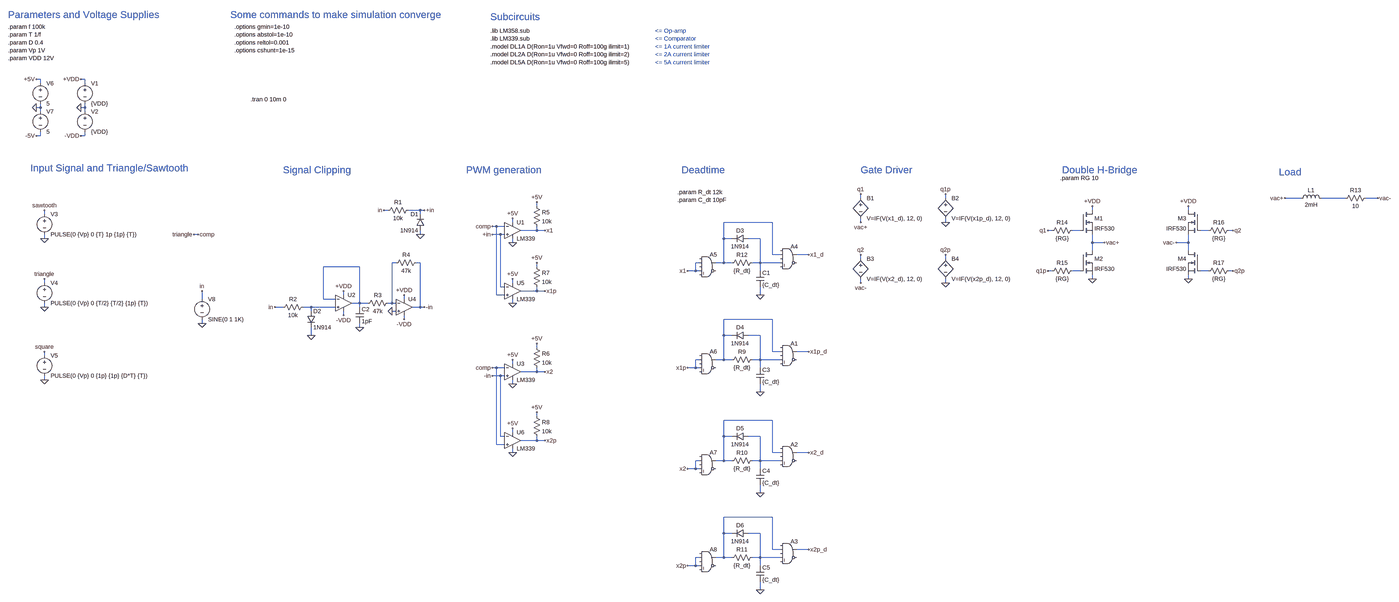
[diagram p0: schematic amp.asc, whole sheet]
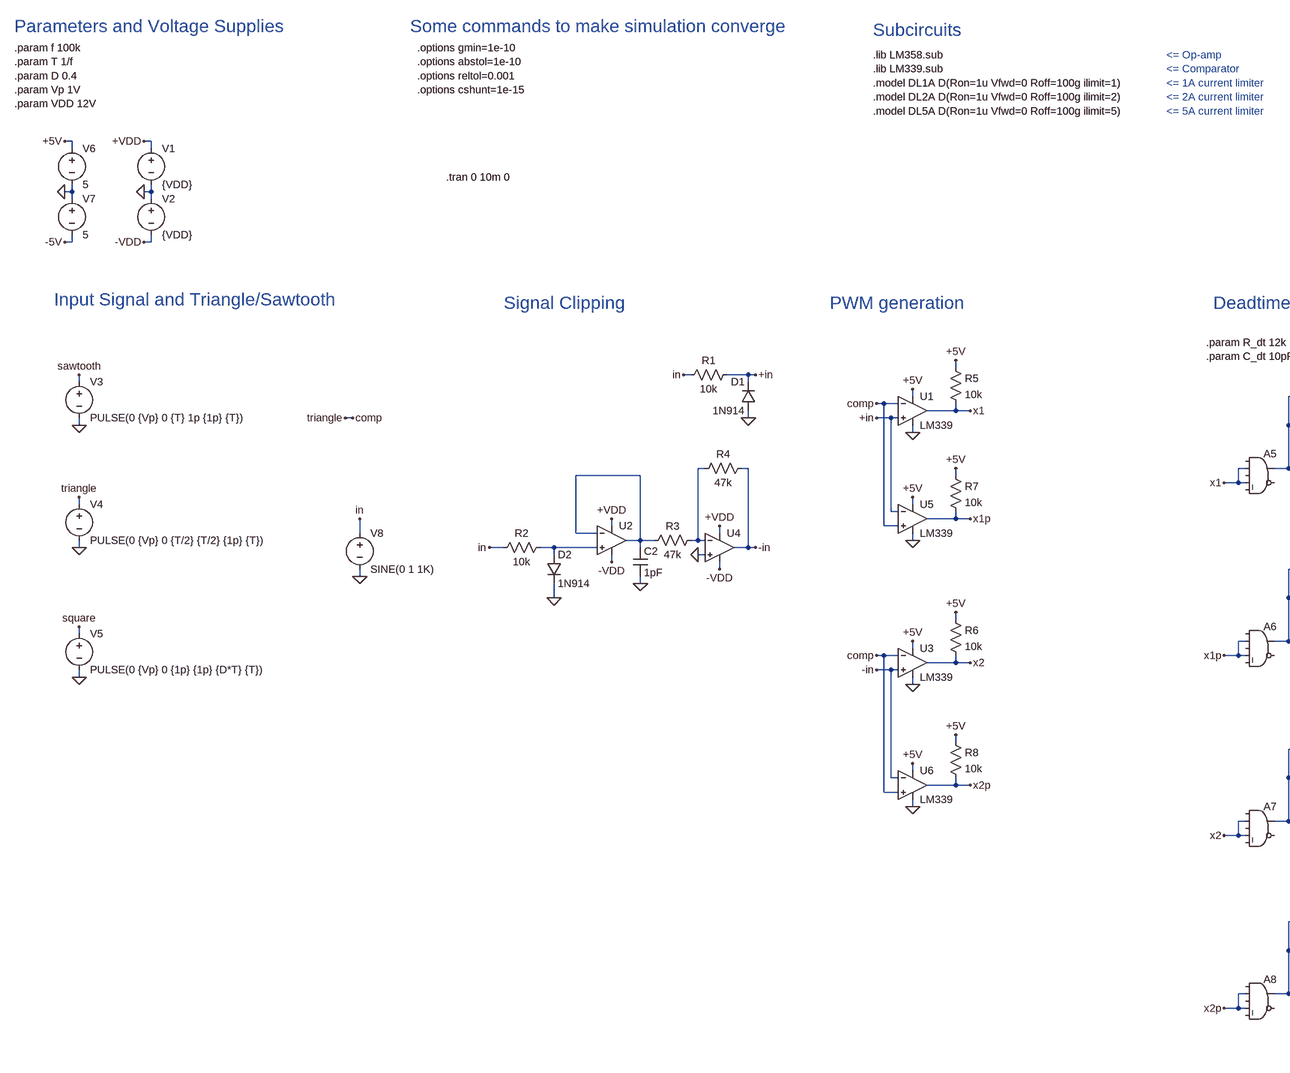
[diagram p1: schematic amp.asc, part, row 1 of 1, column 1 of 2]
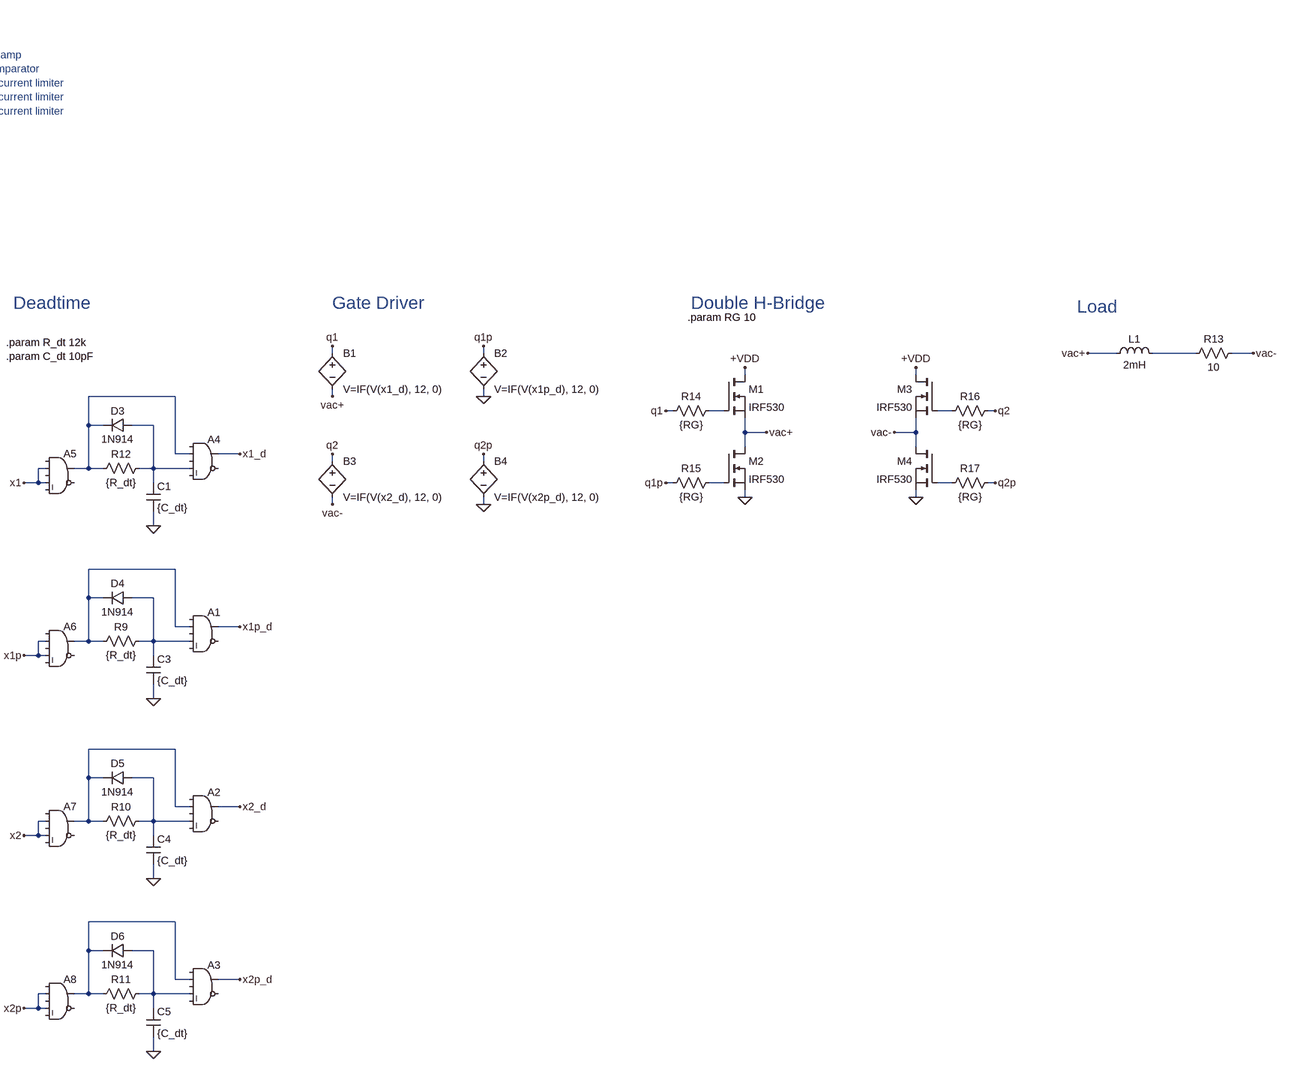
[diagram p2: schematic amp.asc, part, row 1 of 1, column 2 of 2]
amp.asc, the LTspice schematic file:
Version 4
SHEET 1 5540 1748
WIRE -336 -368 -352 -368
WIRE -160 -368 -176 -368
WIRE -336 -352 -336 -368
WIRE -160 -352 -160 -368
WIRE -336 -256 -336 -272
WIRE -336 -256 -352 -256
WIRE -160 -256 -160 -272
WIRE -160 -256 -176 -256
WIRE -336 -240 -336 -256
WIRE -160 -240 -160 -256
WIRE -336 -144 -336 -160
WIRE -336 -144 -352 -144
WIRE -160 -144 -160 -160
WIRE -160 -144 -176 -144
WIRE 3088 128 3088 112
WIRE 3424 128 3424 112
WIRE 5168 128 5104 128
WIRE 5344 128 5248 128
WIRE 5472 128 5424 128
WIRE 1696 160 1696 144
WIRE 1040 176 1024 176
WIRE 1168 176 1120 176
WIRE 1184 176 1168 176
WIRE 4192 176 4192 160
WIRE 4592 176 4592 160
WIRE -320 192 -320 176
WIRE 1168 192 1168 176
WIRE 1600 224 1600 208
WIRE 2640 224 2448 224
WIRE 3088 224 3088 208
WIRE 3424 224 3424 208
WIRE 1536 240 1520 240
WIRE 1568 240 1536 240
WIRE 1696 256 1696 240
WIRE 1696 256 1632 256
WIRE 1728 256 1696 256
WIRE 4032 256 4016 256
WIRE 4144 256 4112 256
WIRE 4672 256 4640 256
WIRE 4768 256 4752 256
WIRE 288 272 272 272
WIRE 1168 272 1168 256
WIRE 1552 272 1520 272
WIRE 1568 272 1552 272
WIRE -320 288 -320 272
WIRE 2448 288 2448 224
WIRE 2480 288 2448 288
WIRE 2592 288 2544 288
WIRE 1600 304 1600 288
WIRE 4192 304 4192 272
WIRE 4240 304 4192 304
WIRE 4592 304 4592 272
WIRE 4592 304 4544 304
WIRE 4192 336 4192 304
WIRE 4592 336 4592 304
WIRE 2640 352 2640 224
WIRE 2672 352 2640 352
WIRE 2784 352 2736 352
WIRE 3088 368 3088 352
WIRE 3424 368 3424 352
WIRE 1072 384 1056 384
WIRE 1168 384 1152 384
WIRE 2352 384 2336 384
WIRE 2448 384 2448 288
WIRE 2448 384 2416 384
WIRE 2480 384 2448 384
WIRE 2592 384 2592 288
WIRE 2592 384 2560 384
WIRE 2672 384 2592 384
WIRE 928 400 784 400
WIRE 1696 400 1696 384
WIRE 2336 416 2336 384
WIRE 2336 416 2304 416
WIRE 2352 416 2336 416
WIRE 2592 416 2592 384
WIRE 4032 416 4016 416
WIRE 4144 416 4112 416
WIRE 4672 416 4640 416
WIRE 4768 416 4752 416
WIRE 4192 448 4192 432
WIRE 4592 448 4592 432
WIRE -320 464 -320 448
WIRE 1600 464 1600 448
WIRE 3088 464 3088 448
WIRE 3424 464 3424 448
WIRE 1552 480 1552 272
WIRE 1568 480 1552 480
WIRE 1696 496 1696 480
WIRE 1696 496 1632 496
WIRE 1728 496 1696 496
WIRE 864 512 864 496
WIRE 1536 512 1536 240
WIRE 1568 512 1536 512
WIRE 2592 512 2592 480
WIRE 304 528 304 496
WIRE 784 528 784 400
WIRE 832 528 784 528
WIRE 1104 528 1104 512
WIRE 928 544 928 400
WIRE 928 544 896 544
WIRE 960 544 928 544
WIRE 1056 544 1056 384
WIRE 1056 544 1040 544
WIRE 1072 544 1056 544
WIRE 1600 544 1600 528
WIRE -320 560 -320 544
WIRE 624 560 592 560
WIRE 736 560 704 560
WIRE 832 560 736 560
WIRE 928 560 928 544
WIRE 1168 560 1168 384
WIRE 1168 560 1136 560
WIRE 1184 560 1168 560
WIRE 736 576 736 560
WIRE 1072 576 1056 576
WIRE 864 592 864 576
WIRE 1104 608 1104 592
WIRE 2640 608 2448 608
WIRE 304 624 304 608
WIRE 928 640 928 624
WIRE 736 672 736 640
WIRE 2448 672 2448 608
WIRE 2480 672 2448 672
WIRE 2592 672 2544 672
WIRE 1696 720 1696 704
WIRE 2640 736 2640 608
WIRE 2672 736 2640 736
WIRE 2784 736 2736 736
WIRE -320 752 -320 736
WIRE 2352 768 2336 768
WIRE 2448 768 2448 672
WIRE 2448 768 2416 768
WIRE 2480 768 2448 768
WIRE 2592 768 2592 672
WIRE 2592 768 2560 768
WIRE 2672 768 2592 768
WIRE 1600 784 1600 768
WIRE 1536 800 1520 800
WIRE 1568 800 1536 800
WIRE 2336 800 2336 768
WIRE 2336 800 2304 800
WIRE 2352 800 2336 800
WIRE 2592 800 2592 768
WIRE 1696 816 1696 800
WIRE 1696 816 1632 816
WIRE 1728 816 1696 816
WIRE 1552 832 1520 832
WIRE 1568 832 1552 832
WIRE -320 848 -320 832
WIRE 1600 864 1600 848
WIRE 2592 896 2592 864
WIRE 1696 992 1696 976
WIRE 2640 1008 2448 1008
WIRE 1600 1056 1600 1040
WIRE 1552 1072 1552 832
WIRE 1568 1072 1552 1072
WIRE 2448 1072 2448 1008
WIRE 2480 1072 2448 1072
WIRE 2592 1072 2544 1072
WIRE 1696 1088 1696 1072
WIRE 1696 1088 1632 1088
WIRE 1728 1088 1696 1088
WIRE 1536 1104 1536 800
WIRE 1568 1104 1536 1104
WIRE 1600 1136 1600 1120
WIRE 2640 1136 2640 1008
WIRE 2672 1136 2640 1136
WIRE 2784 1136 2736 1136
WIRE 2352 1168 2336 1168
WIRE 2448 1168 2448 1072
WIRE 2448 1168 2416 1168
WIRE 2480 1168 2448 1168
WIRE 2592 1168 2592 1072
WIRE 2592 1168 2560 1168
WIRE 2672 1168 2592 1168
WIRE 2336 1200 2336 1168
WIRE 2336 1200 2304 1200
WIRE 2352 1200 2336 1200
WIRE 2592 1200 2592 1168
WIRE 2592 1296 2592 1264
WIRE 2640 1392 2448 1392
WIRE 2448 1456 2448 1392
WIRE 2480 1456 2448 1456
WIRE 2592 1456 2544 1456
WIRE 2640 1520 2640 1392
WIRE 2672 1520 2640 1520
WIRE 2784 1520 2736 1520
WIRE 2352 1552 2336 1552
WIRE 2448 1552 2448 1456
WIRE 2448 1552 2416 1552
WIRE 2480 1552 2448 1552
WIRE 2592 1552 2592 1456
WIRE 2592 1552 2560 1552
WIRE 2672 1552 2592 1552
WIRE 2336 1584 2336 1552
WIRE 2336 1584 2304 1584
WIRE 2352 1584 2336 1584
WIRE 2592 1584 2592 1552
WIRE 2592 1680 2592 1648
FLAG 1168 272 0
FLAG 1024 176 in
FLAG 1184 176 +in
FLAG 736 672 0
FLAG 592 560 in
FLAG 1600 304 0
FLAG 1520 272 +in
FLAG 1056 576 0
FLAG 1104 512 +VDD
FLAG 1104 608 -VDD
FLAG 1600 864 0
FLAG 1520 240 comp
FLAG 1520 800 comp
FLAG 864 496 +VDD
FLAG 864 592 -VDD
FLAG 928 640 0
FLAG 4192 160 +VDD
FLAG 288 272 comp
FLAG 272 272 triangle
FLAG 4592 160 +VDD
FLAG 4240 304 vac+
FLAG 4544 304 vac-
FLAG 4768 256 q2
FLAG 4768 416 q2p
FLAG 1728 256 x1
FLAG 1728 816 x2
FLAG 1600 544 0
FLAG 1728 496 x1p
FLAG 1600 1136 0
FLAG 1728 1088 x2p
FLAG 2304 416 x1
FLAG 2592 512 0
FLAG -352 -256 0
FLAG -352 -368 +5V
FLAG -352 -144 -5V
FLAG 1600 208 +5V
FLAG 1600 448 +5V
FLAG 1600 768 +5V
FLAG 1600 1040 +5V
FLAG 2592 896 0
FLAG 2784 352 x1_d
FLAG 2784 736 x1p_d
FLAG 3088 112 q1
FLAG 3424 112 q1p
FLAG 3088 352 q2
FLAG 3424 464 0
FLAG 3424 352 q2p
FLAG 1696 144 +5V
FLAG 1696 384 +5V
FLAG 1696 704 +5V
FLAG 1696 976 +5V
FLAG 2304 800 x1p
FLAG 2592 1296 0
FLAG 2592 1680 0
FLAG 2784 1136 x2_d
FLAG 2784 1520 x2p_d
FLAG 2304 1200 x2
FLAG 2304 1584 x2p
FLAG 3088 224 vac+
FLAG 4192 448 0
FLAG 4592 448 0
FLAG 3424 224 0
FLAG 3088 464 vac-
FLAG 5104 128 vac+
FLAG 5472 128 vac-
FLAG 1184 560 -in
FLAG 1520 832 -in
FLAG 4016 256 q1
FLAG 4016 416 q1p
FLAG -176 -256 0
FLAG -176 -368 +VDD
FLAG -176 -144 -VDD
FLAG -320 176 sawtooth
FLAG -320 288 0
FLAG -320 448 triangle
FLAG -320 560 0
FLAG -320 736 square
FLAG -320 848 0
FLAG 304 496 in
FLAG 304 624 0
SYMBOL OpAmps\\opamp2 1600 192 R0
SYMATTR InstName U1
SYMATTR Value LM339
SYMBOL diode 1184 256 R180
WINDOW 0 24 64 Left 2
WINDOW 3 24 0 Left 2
SYMATTR InstName D1
SYMATTR Value 1N914
SYMBOL res 1136 160 R90
WINDOW 0 0 56 VBottom 2
WINDOW 3 32 56 VTop 2
SYMATTR InstName R1
SYMATTR Value 10k
SYMBOL diode 720 576 R0
SYMATTR InstName D2
SYMATTR Value 1N914
SYMBOL res 720 544 R90
WINDOW 0 0 56 VBottom 2
WINDOW 3 32 56 VTop 2
SYMATTR InstName R2
SYMATTR Value 10k
SYMBOL res 1056 528 R90
WINDOW 0 0 56 VBottom 2
WINDOW 3 32 56 VTop 2
SYMATTR InstName R3
SYMATTR Value 47k
SYMBOL OpAmps\\opamp2 1600 752 R0
SYMATTR InstName U3
SYMATTR Value LM339
SYMBOL res 1680 144 R0
SYMATTR InstName R5
SYMATTR Value 10k
SYMBOL res 1680 704 R0
SYMATTR InstName R6
SYMATTR Value 10k
SYMBOL OpAmps\\UniversalOpAmp2 864 544 R0
SYMATTR InstName U2
SYMBOL OpAmps\\UniversalOpAmp2 1104 560 R0
SYMATTR InstName U4
SYMBOL cap 912 560 R0
SYMATTR InstName C2
SYMATTR Value 1pF
SYMBOL res 1168 368 R90
WINDOW 0 0 56 VBottom 2
WINDOW 3 32 56 VTop 2
SYMATTR InstName R4
SYMATTR Value 47k
SYMBOL nmos 4144 176 R0
SYMATTR InstName M1
SYMATTR Value IRF530
SYMBOL nmos 4144 336 R0
SYMATTR InstName M2
SYMATTR Value IRF530
SYMBOL nmos 4640 176 M0
SYMATTR InstName M3
SYMATTR Value IRF530
SYMBOL nmos 4640 336 M0
SYMATTR InstName M4
SYMATTR Value IRF530
SYMBOL OpAmps\\opamp2 1600 432 R0
SYMATTR InstName U5
SYMATTR Value LM339
SYMBOL res 1680 384 R0
SYMATTR InstName R7
SYMATTR Value 10k
SYMBOL OpAmps\\opamp2 1600 1024 R0
SYMATTR InstName U6
SYMATTR Value LM339
SYMBOL res 1680 976 R0
SYMATTR InstName R8
SYMATTR Value 10k
SYMBOL diode 2544 272 R90
WINDOW 0 0 32 VBottom 2
WINDOW 3 32 32 VTop 2
SYMATTR InstName D3
SYMATTR Value 1N914
SYMBOL cap 2576 416 R0
SYMATTR InstName C1
SYMATTR Value {C_dt}
SYMBOL voltage -336 -368 R0
WINDOW 123 0 0 Left 0
WINDOW 39 0 0 Left 0
SYMATTR InstName V6
SYMATTR Value 5
SYMBOL voltage -336 -256 R0
WINDOW 123 0 0 Left 0
WINDOW 39 0 0 Left 0
SYMATTR InstName V7
SYMATTR Value 5
SYMBOL diode 2544 656 R90
WINDOW 0 0 32 VBottom 2
WINDOW 3 32 32 VTop 2
SYMATTR InstName D4
SYMATTR Value 1N914
SYMBOL bv 3088 112 R0
SYMATTR InstName B1
SYMATTR Value V=IF(V(x1_d), 12, 0)
SYMBOL bv 3424 112 R0
SYMATTR InstName B2
SYMATTR Value V=IF(V(x1p_d), 12, 0)
SYMBOL bv 3088 352 R0
SYMATTR InstName B3
SYMATTR Value V=IF(V(x2_d), 12, 0)
SYMBOL bv 3424 352 R0
SYMATTR InstName B4
SYMATTR Value V=IF(V(x2p_d), 12, 0)
SYMBOL Digital\\and 2704 304 R0
SYMATTR InstName A4
SYMBOL Digital\\and 2704 688 R0
SYMATTR InstName A1
SYMBOL Digital\\and 2384 336 R0
SYMATTR InstName A5
SYMBOL Digital\\and 2384 720 R0
SYMATTR InstName A6
SYMBOL diode 2544 1056 R90
WINDOW 0 0 32 VBottom 2
WINDOW 3 32 32 VTop 2
SYMATTR InstName D5
SYMATTR Value 1N914
SYMBOL diode 2544 1440 R90
WINDOW 0 0 32 VBottom 2
WINDOW 3 32 32 VTop 2
SYMATTR InstName D6
SYMATTR Value 1N914
SYMBOL Digital\\and 2704 1088 R0
SYMATTR InstName A2
SYMBOL Digital\\and 2704 1472 R0
SYMATTR InstName A3
SYMBOL Digital\\and 2384 1120 R0
SYMATTR InstName A7
SYMBOL Digital\\and 2384 1504 R0
SYMATTR InstName A8
SYMBOL res 2576 368 R90
WINDOW 0 0 56 VBottom 2
WINDOW 3 32 56 VTop 2
SYMATTR InstName R12
SYMATTR Value {R_dt}
SYMBOL res 2576 752 R90
WINDOW 0 0 56 VBottom 2
WINDOW 3 32 56 VTop 2
SYMATTR InstName R9
SYMATTR Value {R_dt}
SYMBOL cap 2576 800 R0
SYMATTR InstName C3
SYMATTR Value {C_dt}
SYMBOL res 2576 1152 R90
WINDOW 0 0 56 VBottom 2
WINDOW 3 32 56 VTop 2
SYMATTR InstName R10
SYMATTR Value {R_dt}
SYMBOL cap 2576 1200 R0
SYMATTR InstName C4
SYMATTR Value {C_dt}
SYMBOL res 2576 1536 R90
WINDOW 0 0 56 VBottom 2
WINDOW 3 32 56 VTop 2
SYMATTR InstName R11
SYMATTR Value {R_dt}
SYMBOL cap 2576 1584 R0
SYMATTR InstName C5
SYMATTR Value {C_dt}
SYMBOL res 5440 112 R90
WINDOW 0 0 56 VBottom 2
WINDOW 3 32 56 VTop 2
SYMATTR InstName R13
SYMATTR Value 10
SYMBOL res 4128 240 R90
WINDOW 0 0 56 VBottom 2
WINDOW 3 32 56 VTop 2
SYMATTR InstName R14
SYMATTR Value {RG}
SYMBOL res 4128 400 R90
WINDOW 0 0 56 VBottom 2
WINDOW 3 32 56 VTop 2
SYMATTR InstName R15
SYMATTR Value {RG}
SYMBOL res 4768 240 R90
WINDOW 0 0 56 VBottom 2
WINDOW 3 32 56 VTop 2
SYMATTR InstName R16
SYMATTR Value {RG}
SYMBOL res 4768 400 R90
WINDOW 0 0 56 VBottom 2
WINDOW 3 32 56 VTop 2
SYMATTR InstName R17
SYMATTR Value {RG}
SYMBOL voltage -160 -368 R0
WINDOW 123 0 0 Left 0
WINDOW 39 0 0 Left 0
SYMATTR InstName V1
SYMATTR Value {VDD}
SYMBOL voltage -160 -256 R0
WINDOW 123 0 0 Left 0
WINDOW 39 0 0 Left 0
SYMATTR InstName V2
SYMATTR Value {VDD}
SYMBOL voltage -320 176 R0
WINDOW 123 0 0 Left 0
WINDOW 39 0 0 Left 0
SYMATTR InstName V3
SYMATTR Value PULSE(0 {Vp} 0 {T} 1p {1p} {T})
SYMBOL voltage -320 448 R0
WINDOW 123 0 0 Left 0
WINDOW 39 0 0 Left 0
SYMATTR InstName V4
SYMATTR Value PULSE(0 {Vp} 0 {T/2} {T/2} {1p} {T})
SYMBOL voltage -320 736 R0
WINDOW 123 0 0 Left 0
WINDOW 39 0 0 Left 0
SYMATTR InstName V5
SYMATTR Value PULSE(0 {Vp} 0 {1p} {1p} {D*T} {T})
SYMBOL voltage 304 512 R0
WINDOW 123 0 0 Left 0
WINDOW 39 0 0 Left 0
SYMATTR InstName V8
SYMATTR Value SINE(0 1 1K)
SYMBOL ind 5152 144 R270
WINDOW 0 32 56 VTop 2
WINDOW 3 5 56 VBottom 2
SYMATTR InstName L1
SYMATTR Value 2mH
TEXT 496 -288 Left 2 !.tran 0 10m 0
TEXT 432 -576 Left 2 !.options gmin=1e-10\n.options abstol=1e-10\n.options reltol=0.001\n.options cshunt=1e-15
TEXT 2264 104 Left 2 !.param R_dt 12k\n.param C_dt 10pF
TEXT 624 16 Left 4 ;Signal Clipping
TEXT -464 -624 Left 4 ;Parameters and Voltage Supplies
TEXT 1416 16 Left 4 ;PWM generation
TEXT 2280 16 Left 4 ;Deadtime
TEXT 3088 16 Left 4 ;Gate Driver
TEXT 4072 16 Left 4 ;Double H-Bridge
TEXT 5080 24 Left 4 ;Load
TEXT -376 8 Left 4 ;Input Signal and Triangle/Sawtooth
TEXT 416 -624 Left 4 ;Some commands to make simulation converge
TEXT 4064 48 Left 2 !.param RG 10
TEXT -464 -576 Left 2 !.param f 100k\n.param T 1/f\n.param D 0.4\n.param Vp 1V\n.param VDD 12V
TEXT 1512 -616 Left 4 ;Subcircuits
TEXT 1512 -560 Left 2 !.lib LM358.sub\n.lib LM339.sub\n.model DL1A D(Ron=1u Vfwd=0 Roff=100g ilimit=1)\n.model DL2A D(Ron=1u Vfwd=0 Roff=100g ilimit=2)\n.model DL5A D(Ron=1u Vfwd=0 Roff=100g ilimit=5)
TEXT 2176 -560 Left 2 ;<= Op-amp\n<= Comparator\n<= 1A current limiter\n<= 2A current limiter\n<= 5A current limiter

The netlist it stands for:
* amp.asc
XU1 +in triangle +5V 0 x1 LM339  ; pins In+ In- V+ V- OUT
D1 0 +in 1N914
R1 +in in 10k
D2 N010 0 1N914
R2 N010 in 10k
R3 N006 N007 47k
XU3 -in triangle +5V 0 x2 LM339  ; pins In+ In- V+ V- OUT
R5 +5V x1 10k
R6 +5V x2 10k
XU2 N010 N007 +VDD -VDD N007 level2 Avol=1Meg GBW=10Meg Slew=10Meg Ilimit=25m Rail=0 Vos=0 En=0 Enk=0 In=0 Ink=0 Rin=500Meg  ; pins In+ In- V+ V- OUT
XU4 0 N006 +VDD -VDD -in level2 Avol=1Meg GBW=10Meg Slew=10Meg Ilimit=25m Rail=0 Vos=0 En=0 Enk=0 In=0 Ink=0 Rin=500Meg  ; pins In+ In- V+ V- OUT
C2 N007 0 1pF
R4 -in N006 47k
M1 +VDD N003 vac+ vac+ IRF530
M2 vac+ N008 0 0 IRF530
M3 +VDD N004 vac- vac- IRF530
M4 vac- N009 0 0 IRF530
XU5 triangle +in +5V 0 x1p LM339  ; pins In+ In- V+ V- OUT
R7 +5V x1p 10k
XU6 triangle -in +5V 0 x2p LM339  ; pins In+ In- V+ V- OUT
R8 +5V x2p 10k
D3 N005 N002 1N914
C1 N005 0 {C_dt}
V6 +5V 0 5
V7 0 -5V 5
D4 N012 N011 1N914
B1 q1 vac+ V=IF(V(x1_d), 12, 0)
B2 q1p 0 V=IF(V(x1p_d), 12, 0)
B3 q2 vac- V=IF(V(x2_d), 12, 0)
B4 q2p 0 V=IF(V(x2p_d), 12, 0)
A4 0 N002 0 N005 0 0 x1_d 0 AND
A1 0 N011 0 N012 0 0 x1p_d 0 AND
A5 0 x1 0 x1 0 0 N002 0 AND
A6 0 x1p 0 x1p 0 0 N011 0 AND
D5 N014 N013 1N914
D6 N016 N015 1N914
A2 0 N013 0 N014 0 0 x2_d 0 AND
A3 0 N015 0 N016 0 0 x2p_d 0 AND
A7 0 x2 0 x2 0 0 N013 0 AND
A8 0 x2p 0 x2p 0 0 N015 0 AND
R12 N005 N002 {R_dt}
R9 N012 N011 {R_dt}
C3 N012 0 {C_dt}
R10 N014 N013 {R_dt}
C4 N014 0 {C_dt}
R11 N016 N015 {R_dt}
C5 N016 0 {C_dt}
R13 vac- N001 10
R14 N003 q1 {RG}
R15 N008 q1p {RG}
R16 q2 N004 {RG}
R17 q2p N009 {RG}
V1 +VDD 0 {VDD}
V2 0 -VDD {VDD}
V3 sawtooth 0 PULSE(0 {Vp} 0 {T} 1p {1p} {T})
V4 triangle 0 PULSE(0 {Vp} 0 {T/2} {T/2} {1p} {T})
V5 square 0 PULSE(0 {Vp} 0 {1p} {1p} {D*T} {T})
V8 in 0 SINE(0 1 1K)
L1 vac+ N001 2mH
.model D D
.lib standard.dio
.model NMOS NMOS
.model PMOS PMOS
.lib standard.mos
.tran 0 10m 0
.options gmin=1e-10
.options abstol=1e-10
.options reltol=0.001
.options cshunt=1e-15
.param R_dt 12k
.param C_dt 10pF
* Signal Clipping
* Parameters and Voltage Supplies
* PWM generation
* Deadtime
* Gate Driver
* Double H-Bridge
* Load
* Input Signal and Triangle/Sawtooth
* Some commands to make simulation converge
.param RG 10
.param f 100k
.param T 1/f
.param D 0.4
.param Vp 1V
.param VDD 12V
* Subcircuits
.lib LM358.sub
.lib LM339.sub
.model DL1A D(Ron=1u Vfwd=0 Roff=100g ilimit=1)
.model DL2A D(Ron=1u Vfwd=0 Roff=100g ilimit=2)
.model DL5A D(Ron=1u Vfwd=0 Roff=100g ilimit=5)
* <= Op-amp
* <= Comparator
* <= 1A current limiter
* <= 2A current limiter
* <= 5A current limiter
.lib UniversalOpAmp2.lib
.backanno
.end